# Altium schematic sheet BUCK.SchDoc
size Legal; Author: Mark & Qiming; DocumentNumber: 8; SheetNumber: 7; SheetTotal: 9
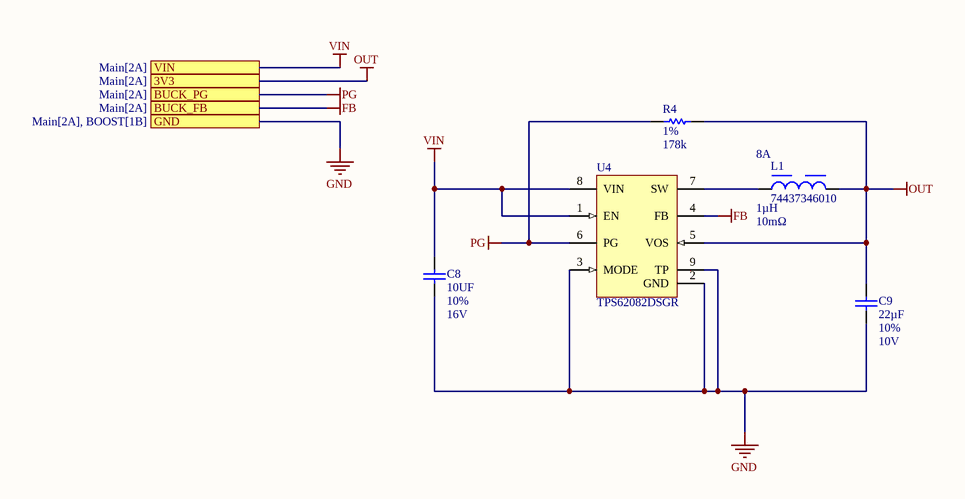
[diagram p0: BUCK.SchDoc]

## Parts
C8  value 10UF  Tolerance: 10%  Voltage: 16V  [1206_CAP]  (hidden comment: CAP 1206 10UF 16V 10% X7R)
C9  value 22µF  Tolerance: 10%  Voltage: 10V  [1206_CAP_75H]  (hidden comment: CAP 1206 22UF 10V 10% X7R)
L1  74437346010  Series Resistance: 10mΩ  Inductance: 1µH  Current Rating: 8A  [WE-LHMI_7030]
R4  value 178k  Tolerance: 1%  [0603_RES]  (hidden comment: RES 0603 178K 1%)
U4  TPS62082DSGR  [DSG0008A_V]

## Ports
3V3 (see Main[2A]), BUCK_FB (see Main[2A]), BUCK_PG (see Main[2A]), GND (see Main[2A], BOOST[1B]), VIN (see Main[2A])

## Nets
FB: U4.4(FB) ; port BUCK_FB
GND: C8.1 C9.1 U4.2(GND) U4.3(MODE) U4.9(TP) ; port GND
OUT: C9.2 L1.2 R4.1 U4.5(VOS) ; port 3V3
PG: R4.2 U4.6(PG) ; port BUCK_PG
VIN: C8.2 U4.1(EN) U4.8(VIN) ; port VIN
NetL1_1: L1.1 U4.7(SW)

## Notes on the sheet
- Title:
- Desc:
- Size:
- Letter
- Auth:
- Proj:
- Sheet
- of
- www.seas.upenn.edu
- Electrical and Systems Engineering

## Library data of the parts
C8 = CMP-011-000639-1: Capacitor Surface Mount 1206 Footprint 10UF 16V 10% Tolerance Ceramic X7R; Manufacturer: Various; PCB Package: 1206; Description in Visual: Cap SMT 1206 10UF 16V 10%  Cer X7R; Type: Ceramic X7R; Mount: SMT; P/N: CAP 1206 10UF 16V 10% X7R; Manufacturer P/N: CAP 1206 10UF 16V 10% X7R
C9 = CMP-011-000660-3: Capacitor Surface Mount 1206 Footprint 22UF 10V 10% Tolerance Ceramic X7R; Manufacturer: Various; PCB Package: 1206; Description in Visual: Cap SMT 1206 22UF 10V 10%  Cer X7R; Manufacturer P/N: CAP 1206 22UF 10V 10% X7R; RoHS: Yes; P/N: CAP 1206 22UF 10V 10% X7R; Case/Package: 1206; JLCPCB Part #: C5672; Mount: SMT; Type: Ceramic X7R; Capacitor Type: Ceramic
L1 = CMP-1353-00047-3: NexarPartId: 22866635; Shielding: Shielded; Core Material: Composite, Ferrite; DC Resistance (DCR): 8.3mΩ; Frequency: 54MHz; Inductance Tolerance: 20%; Test Frequency: 100kHz; Saturation Current: 14.7A; Length: 7.3mm; Depth: 6.6mm; Max Operating Temperature: 125°C; Min Operating Temperature: -40°C; Packaging: Tape & Reel (TR); Mount: Surface Mount; Self Resonant Frequency: 54MHz; REACH SVHC: Unknown; RMS Current (Irms): 8A; RoHS: Compliant; Height: 2.8mm; Ambient Temperature Range Low: -40°C; Tolerance: 20%; Width: 6.6mm; Composition: Wirewound; Height - Seated (Max): 3.0988mm; Case/Package: Nonstandard; Ambient Temperature Range High: 85°C; Max DC Current: 8A; Termination: SMD/SMT
R4 = CMP-005-002436-2: Resistor Surface Mount, 178K Ohms, 0603 Footprint, 1% Tolerance 0.1W; Manufacturer: Various; PCB Package: 0603; Description in Visual: Res SMT 178K 0603  1%  0.1W; Mount: SMT; Manufacturer P/N: RES 0603 178K 1%; Power Rating: 0.1W
U4 = CMP-0323-00344-3: Buck Step Down Regulator with 2.3 to 6 V Input and 3.3 V Output, -40 to 85 degC, 8-Pin WSON (DSG), Green (RoHS & no Sb/Br); Manufacturer: Texas Instruments; Switch Current Limit(Typ)(A): 2.4; Vin(Min)(V): 2.3; Iq(Typ)(mA): 0.006; Regulated Outputs(#): 1; Vout(Max)(V): 3.3; Duty Cycle(Max)(%): 100; Iout(Max)(A): 1.2; SubFamily: Step-Down Regulator; Rating: Catalog; Vin(Max)(V): 6; ComponentLink1Description: Datasheet; ComponentLink3Description: URL Link1; ComponentLink2URL: http://www.ti.com/litv/pdf/mpds308a; DatasheetVersion: SLVSAE8B; PackageVersion: revB, Oct-2010; Eco-Plan: Green (RoHS & no Sb/Br); ComponentLink2Description: Package Specification; PackageReference: DSG0008A; Code_JEDEC: MO-229; Topology: Buck; PartNumber: TPS62082DSGR; PackageDescription: 8-Pin Plastic Small Outline No-Lead, 2 x 2 x 0.8 mm Body, 0.5 mm Pitch, Exposed Pad; ComponentLink1URL: http://www.ti.com/general/docs/lit/getliterature.tsp?genericPartNumber=TPS62082&fileType=pdf; ComponentLink3URL: Samples URL:http://www.ti.com/product/tps62082#samples; Vout(Min)(V): 3.3; Mounting Technology: Surface Mount